# Altium schematic sheet 04-Front Panel SFP_2.SchDoc
size A4; SheetNumber: 4; SheetTotal: 12
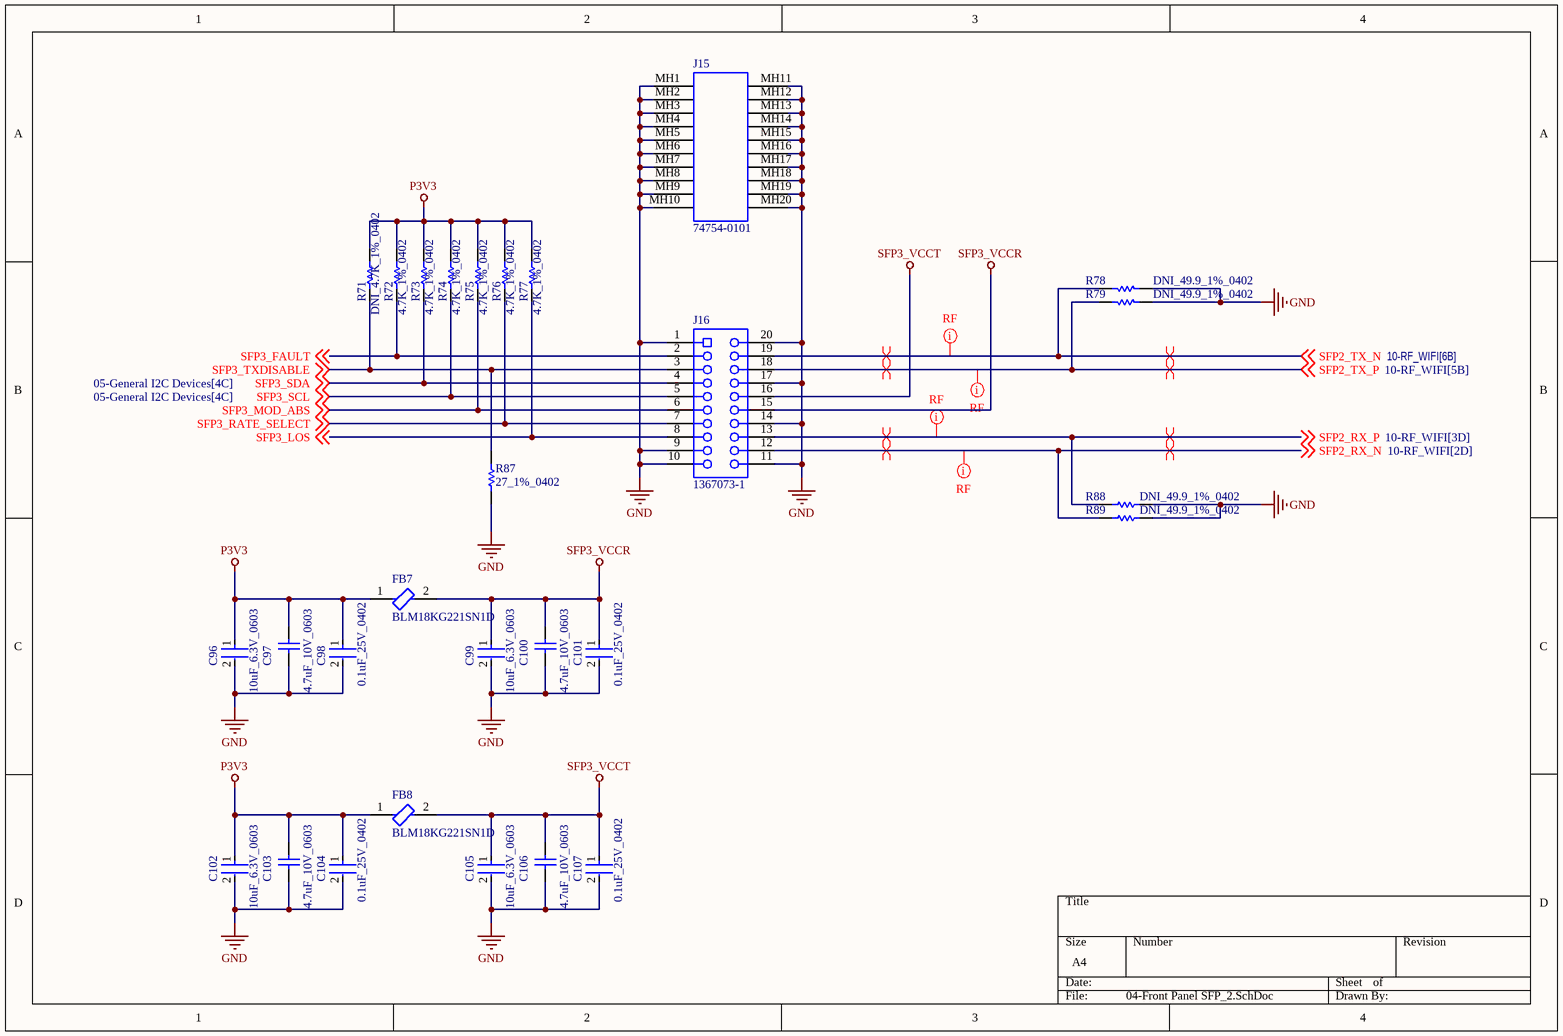
[diagram p0: 04-Front Panel SFP_2.SchDoc]

## Parts
C96  10uF_6.3V_0603  [FP-C0603C106M9PACTU-MFG]
C97  4.7uF_10V_0603  [CAPC1608X87X35NL15T15]
C98  0.1uF_25V_0402  [FP-0402-L_1_0_1-W_0_5_0_1-IPC_C]
C99  10uF_6.3V_0603  [FP-C0603C106M9PACTU-MFG]
C100  4.7uF_10V_0603  [CAPC1608X87X35NL15T15]
C101  0.1uF_25V_0402  [FP-0402-L_1_0_1-W_0_5_0_1-IPC_C]
C102  10uF_6.3V_0603  [FP-C0603C106M9PACTU-MFG]
C103  4.7uF_10V_0603  [CAPC1608X87X35NL15T15]
C104  0.1uF_25V_0402  [FP-0402-L_1_0_1-W_0_5_0_1-IPC_C]
C105  10uF_6.3V_0603  [FP-C0603C106M9PACTU-MFG]
C106  4.7uF_10V_0603  [CAPC1608X87X35NL15T15]
C107  0.1uF_25V_0402  [FP-0402-L_1_0_1-W_0_5_0_1-IPC_C]
FB7  BLM18KG221SN1D  [FP-BLM18-0_15-t0_8-IPC_B]
FB8  BLM18KG221SN1D  [FP-BLM18-0_15-t0_8-IPC_B]
J15  74754-0101  [MOLX-74754-0101_V]
J16  1367073-1  [TECO-1367073-1_V]
R71  DNI_4.7K_1%_0402  [RESC1005X40X25NL10T10]  (no BOM)
R72  4.7K_1%_0402  [RESC1005X40X25NL10T10]
R73  4.7K_1%_0402  [RESC1005X40X25NL10T10]
R74  4.7K_1%_0402  [RESC1005X40X25NL10T10]
R75  4.7K_1%_0402  [RESC1005X40X25NL10T10]
R76  4.7K_1%_0402  [RESC1005X40X25NL10T10]
R77  4.7K_1%_0402  [RESC1005X40X25NL10T10]
R78  DNI_49.9_1%_0402  [RESC1005X40X25NL10T10]  (no BOM)
R79  DNI_49.9_1%_0402  [RESC1005X40X25NL10T10]  (no BOM)
R87  27_1%_0402  [RESC1005X40X25NL05T05]
R88  DNI_49.9_1%_0402  [RESC1005X40X25NL10T10]  (no BOM)
R89  DNI_49.9_1%_0402  [RESC1005X40X25NL10T10]  (no BOM)

## Nets
GND: C96.2 C97.1 C98.2 C99.2 C100.1 C101.2 C102.2 C103.1 C104.2 C105.2 C106.1 C107.2 J15.MH1 J15.MH2 J15.MH3 J15.MH4 J15.MH5 J15.MH6 J15.MH7 J15.MH8 J15.MH9 J15.MH10 J15.MH11 J15.MH12 J15.MH13 J15.MH14 J15.MH15 J15.MH16 J15.MH17 J15.MH18 J15.MH19 J15.MH20 J16.1 J16.9 J16.10 J16.11 J16.14 J16.17 J16.20 R78.2 R79.2 R87.1 R88.2 R89.2
P3V3: C96.1 C97.2 C98.1 C102.1 C103.2 C104.1 FB7.1 FB8.1 R71.1 R72.1 R73.1 R74.1 R75.1 R76.1 R77.1
SFP3_VCCR: C99.1 C100.2 C101.1 FB7.2 J16.15
SFP3_VCCT: C105.1 C106.2 C107.1 FB8.2 J16.16
SFP2_RX_N: J16.12 R89.1 ; off-sheet SFP2_RX_N
SFP2_RX_P: J16.13 R88.1 ; off-sheet SFP2_RX_P
SFP2_TX_N: J16.19 R78.1 ; off-sheet SFP2_TX_N
SFP2_TX_P: J16.18 R79.1 ; off-sheet SFP2_TX_P
SFP3_FAULT: J16.2 R72.2 ; off-sheet SFP3_FAULT
SFP3_LOS: J16.8 R77.2 ; off-sheet SFP3_LOS
SFP3_MOD_ABS: J16.6 R75.2 ; off-sheet SFP3_MOD_ABS
SFP3_RATE_SELECT: J16.7 R76.2 ; off-sheet SFP3_RATE_SELECT
SFP3_SCL: J16.5 R74.2 ; off-sheet SFP3_SCL
SFP3_SDA: J16.4 R73.2 ; off-sheet SFP3_SDA
SFP3_TXDISABLE: J16.3 R71.2 R87.2 ; off-sheet SFP3_TXDISABLE

## Layout directives
differential pair: SFP2_RX_N, SFP2_RX_P, SFP2_TX_N, SFP2_TX_P
net class RF: SFP2_RX_N, SFP2_RX_P, SFP2_TX_N, SFP2_TX_P

## Library data of the parts
C96 C99 C102 C105 = CMP-2006-02285-3: CAP CER 10UF 6.3V X5R 0603; Manufacturer Part Number: C0603C106M9PACTU; Manufacturer: Kemet; Material: Ceramic; Temperature Coefficient: 15%; Tolerance: 20%; Category: Cap; Height: 0.9mm; Digikey Description: CAP CER 10UF 6.3V X5R 0603; Mouser Description: In a Pack of 10, KEMET 0603 (1608M) 10µF MLCC 6.3V dc ±20% SMD C0603C106M9PACTU; Voltage Rating: 6.3V; Device Class L2: Capacitors; Temperature Range Low: -55°C; Temperature Characteristic: X5R; ComponentLink2Description: Datasheet; Ipc Land Pattern Name: CAPC16080X80; ComponentLink2URL: http://www.kemet.com/Lists/ProductCatalog/Attachments/19/KEM_C1006_X5R_SMD.pdf; Capacitance: 10uF; Temperature Range High: +85°C; Device Class L3: Ceramic Capacitors; RoHS: TRUE; Automotive: No; Value: 10uF; Temperature: -55°C to +85°C; Device Class L1: Passive Components; Package: C0603C106M9PACTU; Lead Free: Yes; Octopart: https://octopart.com/c0603c106m9pactu-kemet-8375727
C97 C100 C103 C106 = CMP-2006-03238-1: Part Number: C0603C475K8PACTU; Manufacturer: Kemet
C98 C101 C104 C107 = CMP-2008-02519-2: General Purpose Ceramic Capacitor, 0402, 100nF, 10%, X7R, 15%, 25V; Package Quantity: 1; Capacitance: 100nF; Min Operating Temperature: -55°C; Voltage: 25V; Voltage Rating: 25V; Construction: Flat; Max Operating Temperature: 125°C; Radiation Hardening: No; Depth: 0.5mm; Thickness: 0.022inch; Voltage Rating (DC): 25V; Number of Pins: 2; Lead Free: Lead Free; Series: -; REACH SVHC: No SVHC; Length: 1mm; Dielectric: X7R; RoHS Compliant: Yes; Mount: Surface Mount; Packaging: Tape and Reel; Case/Package: 0402; Case Code (Imperial): 0402; Termination: SMD/SMT; Width: 0.02inch; Case Code (Metric): 1005; Tolerance: 10%
FB7 FB8 = CMP-0686-00556-7: Chip Ferrite Bead, 0603, 220Ω @ 100MHz, 0.05Ω, 25%, 2.2A; DC Resistance (DCR): 50mR; Number of Circuits: 1; Impedance: 220R; Current Rating: 2.2A; Material: Ferrite; Test Frequency: 100MHz; Depth: 0.8mm; Series: BLM18K; RoHS Compliant: Yes; Termination: SMD/SMT; Max Current Rating: 2.2A; Case Code (Metric): 1608; Radiation Hardening: No; Number of Pins: 2; Length: 1.6mm; Lead Free: Lead Free; Package Quantity: 1; Height: 0.8mm; Core Material: Ferrite; Inductor Type: FERRITE BEAD; Min Operating Temperature: -55°C; Case/Package: 0603; Case Code (Imperial): 0603; Number of Lines: 1; Packaging: Tape and Reel; REACH SVHC: No SVHC; Max Operating Temperature: 125°C; Military Standard: Not; DC Resistance-Max: 50mR; Width: 0.8mm; DC Current: 2.2A; Max DC Current: 2.2A; Tolerance: 25%; Weight: 7.1E-05oz
J15 = CMP-1704-00003-3: SFP+ Cage, Single Port, Height 10.85 mm, Tail Height 3.05 mm, -40 to 85 degC, RoHS, Tray; RoHSCompliant: True; ComponentLink3URL: http://www.molex.com/pdm_docs/sd/747540101_sd.pdf; Width: 49 mm; Height: 10.85 mm; Mounting Technology: Through Hole; ComponentLink2Description: Datasheet; ComponentLink3Description: Package Specification; DatasheetVersion: Rev. Jul-15; Package Quantity: 1152; PackageDescription: SFP+ Cage, Single Port, Height 10.85 mm, Tail Height 3.05 mm; Radiation Hardening: No; PackageVersion: Rev. J, 02/2015; ComponentLink1Description: Manufacturer URL; PartNumber: 74754-0101; ComponentLink1URL: http://www.molex.com/; Packaging: Tray; Length: 15.9 mm; ComponentLink2URL: http://www.molex.com/webdocs/datasheets/pdf/en-us/0747540101_IO_CONNECTORS.pdf
J16 = CMP-2000-05488-1: Female Connector, Pitch 0.8 mm, 2 x 10 Position, Height 5.4 mm, -55 to 85 degC, RoHS, Tape and Reel; Manufacturer: TE Connectivity; Product Training Modules: HighSpeedPluggableI/OSolutions; 3D Model: 1367073-1.pdf; Connector Type: SFP; Other Names: A97430DKR; Mating Products: 516-2084-ND / -TXRXOPTICALSFF1.25GBDISCSI; Dynamic Catalog: SFPConnectors; Featured Product: HighSpeedPluggableI-OSolutions; Connector Style: Receptacle; Associated Product: A103997CT-ND / -CONNSFPCAGESINGLEW/OPIPE / A103997TR-ND / -CONNSFPCAGESINGLEW/OPIPE / 1367645-3-ND / -CONNCAGE&HEATSINKSGLPORTTIN / 1367645-2-ND / -CONNCAGE&HEATSINKSGLPORTTIN / 1888424-1-ND / -CONNCAGE1X2SFPENHANCEDEMI / 1367643-1-ND / -CONNCAGESNGLPORTDBLSIDETIN / 1489962-1-ND / -CONNSFPCAGESINGLEW/OPIPE / 1367645-1-ND / -CONNCAGE&HEATSINKSGLPORTTIN / A99375-ND / -CONNSFPCAGE1X4PIN-IN-PASTE / A97412CT-ND / -CONNSFPLOWERCAGEPCB / More...; Number of Positions: 20; Package Reference: 1367073-1; Package Description: Female Connector, Pitch 0.8 mm, 2 x 10 Position, Height 5.4 mm; RoHS Information: 1367073-1StatementofCompliance; Contact Finish: Gold; Datasheet URL: http://www.te.com/commerce/DocumentDelivery/DDEController?Action=showdoc&DocId=Customer+Drawing%7F1367073%7FK%7Fpdf%7FEnglish%7FENG_CD_1367073_K.pdf%7F1367073-1; Datasheet Version: Rev. K, 12/2012; Contact Finish Thickness: 15µin(0.38µm); Category: Connectors,Interconnects; Mounting Type: SurfaceMount,RightAngle; Mounting Technology: SurfaceMount; Packaging: Digi-Reel®; Manufacturer URL: http://www.te.com/; Family: PluggableConnectors; Standard Package: 1; Termination: Solder
R71-R77 = CMP-2002-05217-1: Manufacturer: Bourns; Part Number: CR0402-FX-4701GLF
R78 R79 R88 R89 = CMP-2002-04448-1: Part Number: RK73H1ETTP49R9F; Manufacturer: KOA Speer
R87 = CMP-2002-08434-1: Part Number: CRCW040227R0FKED; Manufacturer: Vishay Dale